# EAGLE design shield_v9 (EAGLE 6.5.0)
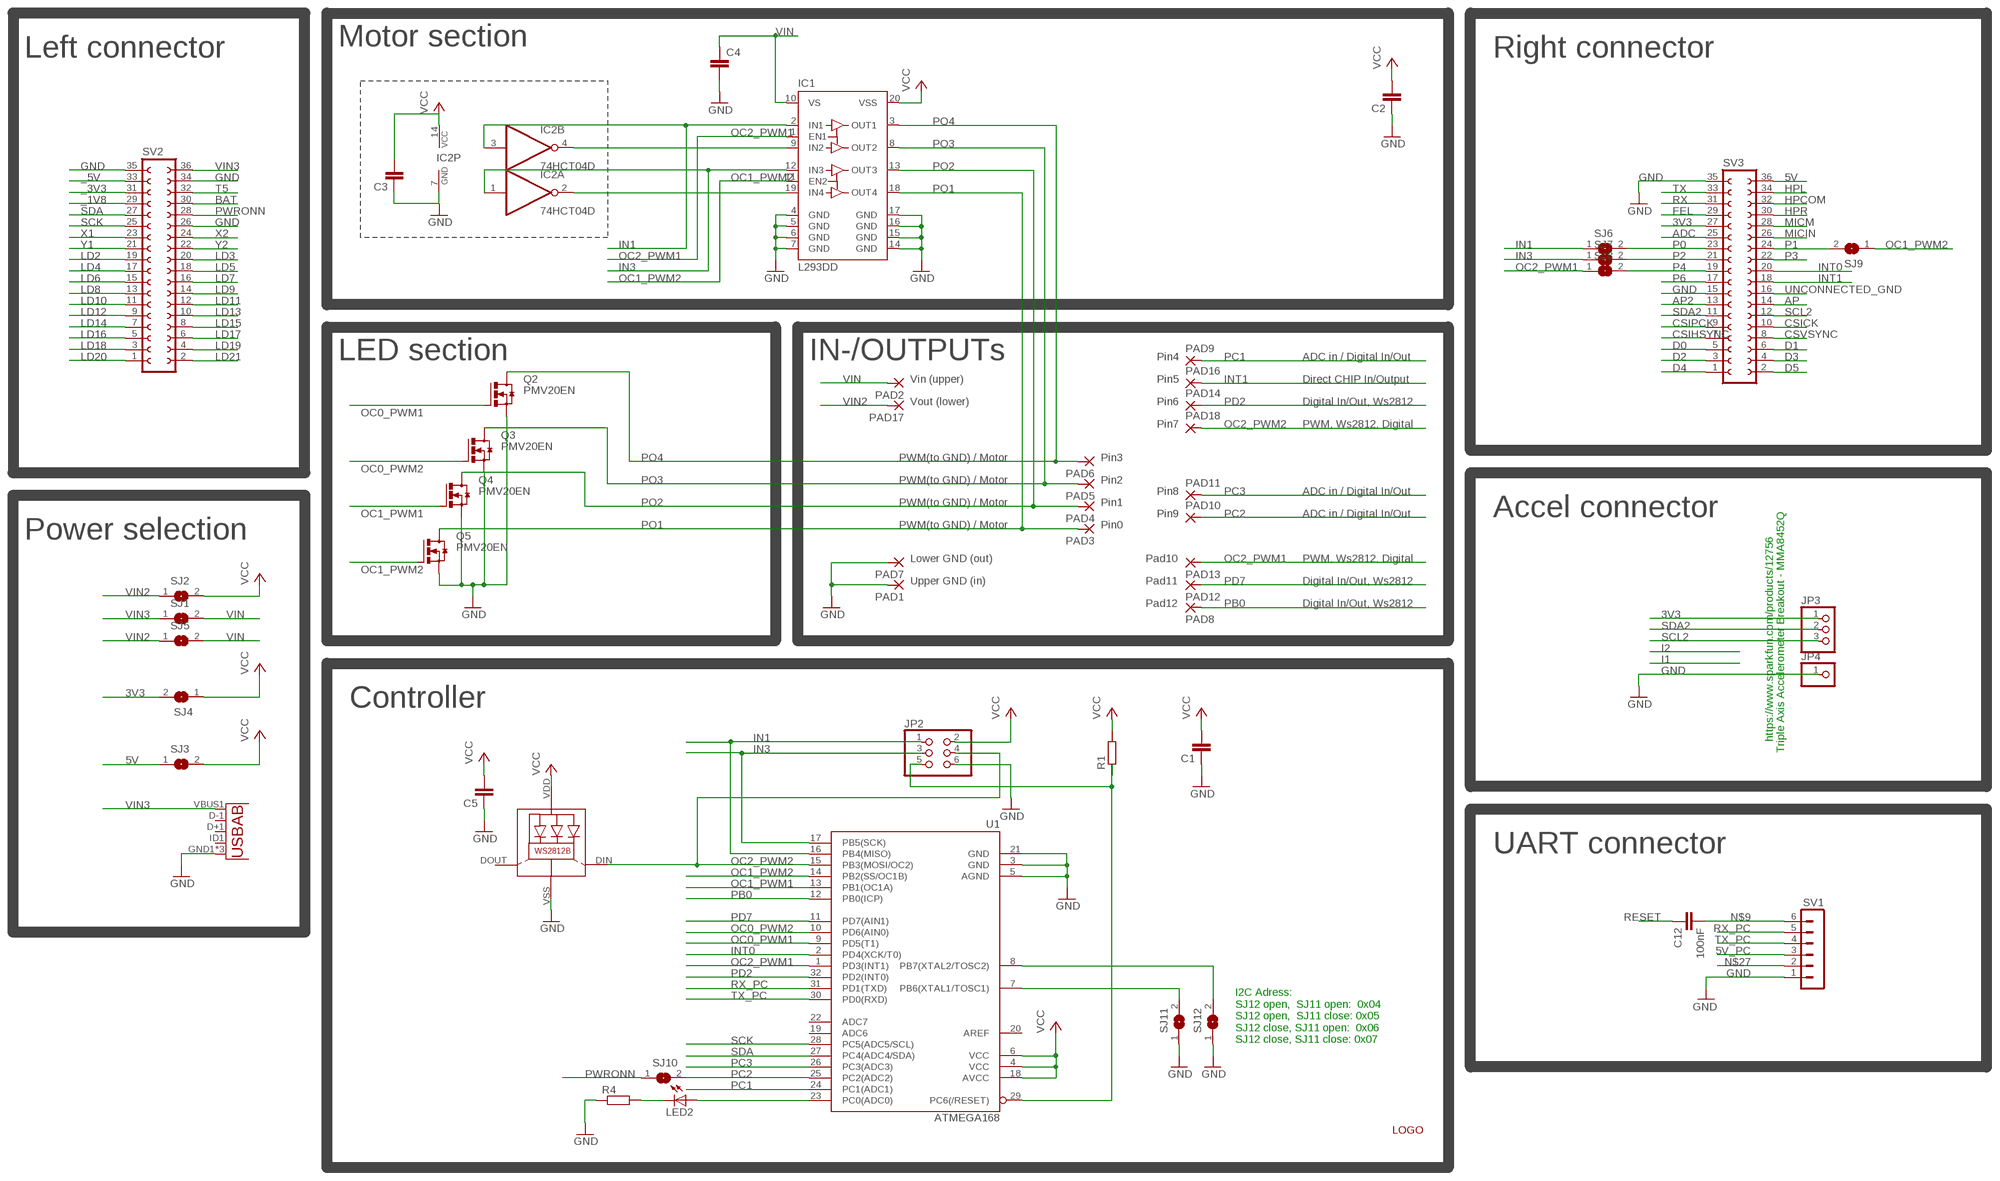
[diagram p0: schematic, sheet 1]

## Parts
C1  C-EUC0805  [C0805]
C2  C-EUC0805  [C0805]
C3  C-EUC0805  [C0805]
C4  C-EUC1210  [C1210]
C5  C-EUC0805  [C0805]
C12  100nF  C-EUC1206  [C1206]
IC1  L293DD  [SO20]
IC2  74HCT04D  [SO14]
JP2  PINHD-2X3  [2X03]
JP3  PINHD-1X3  [1X03]
JP4  PINHD-1X1  [1X01]
LED1  WS2812B  [WS2812B]
LED2  LEDCHIP-LED0805  [CHIP-LED0805]
PAD1  3,17/1,3  [3,17/1,3]
PAD2  3,17/1,3  [3,17/1,3]
PAD3  3,17/1,3  [3,17/1,3]
PAD4  3,17/1,3  [3,17/1,3]
PAD5  3,17/1,3  [3,17/1,3]
PAD6  3,17/1,3  [3,17/1,3]
PAD7  3,17/1,3  [3,17/1,3]
PAD8  WIREPADSMD1,27-254  [SMD1,27-2,54]
PAD9  3,17/1,3  [3,17/1,3]
PAD10  3,17/1,3  [3,17/1,3]
PAD11  3,17/1,3  [3,17/1,3]
PAD12  SMD2  [SMD1,27-2,54]
PAD13  SMD2  [SMD1,27-2,54]
PAD14  3,17/1,3  [3,17/1,3]
PAD16  3,17/1,3  [3,17/1,3]
PAD17  3,17/1,3  [3,17/1,3]
PAD18  3,17/1,3  [3,17/1,3]
Q2  PMV20EN  NMOSFET_SMD_223  [SOT223]
Q3  PMV20EN  NMOSFET_SMD_223  [SOT223]
Q4  PMV20EN  NMOSFET_SMD_223  [SOT223]
Q5  PMV20EN  NMOSFET_SMD_223  [SOT223]
R1  R-EU_M1206  [M1206]
R4  R-EU_M1206  [M1206]
SJ1  SJ  [SJ]
SJ2  SJ  [SJ]
SJ3  SJ  [SJ]
SJ4  SJ  [SJ]
SJ5  SJ  [SJ]
SJ6  SJ  [SJ]
SJ7  SJ  [SJ]
SJ8  SJ  [SJ]
SJ9  SJ  [SJ]
SJ10  SJ  [SJ]
SJ11  SJ  [SJ]
SJ12  SJ  [SJ]
SV1  MA06-1  [MA06-1]
SV2  FE18-2  [FE18-2]
SV3  FE18-2  [FE18-2]
U1  ATMEGA168  [TQFP32-08]
U2  USB""  [USB-MICRO-SMD]
U$2  LOGO  [LOGO]

## Nets
3V3: JP3.1 SJ4.2 SV3.27
5V: SJ3.1 SV3.36
5V_PC: SV1.3
_1V8: SV2.29
_3V3: SV2.31
_5V: SV2.33
ADC: SV3.25
AP: SV3.14
AP2: SV3.13
BAT: SV2.30
CSICK: SV3.10
CSIHSYNC: SV3.7
CSIPCK: SV3.9
CSVSYNC: SV3.8
D0: SV3.5
D1: SV3.6
D2: SV3.3
D3: SV3.4
D4: SV3.1
D5: SV3.2
FEL: SV3.29
GND: C1.1 C2.1 C3.1 C4.2 C5.1 IC1.4(GND) IC1.5(GND) IC1.6(GND) IC1.7(GND) IC1.14(GND) IC1.15(GND) IC1.16(GND) IC1.17(GND) IC2.7(P:GND) JP2.6 JP4.1 LED1.VSS(GND) PAD1.1(P) PAD7.1(P) Q2.3(S) Q3.3(S) Q4.3(S) Q5.3(S) R4.1 SJ11.1 SJ12.1 SV1.1 SV2.26 SV2.34 SV2.35 SV3.15 SV3.35 U1.3(GND) U1.5(AGND) U1.21(GND) U2.GND1(GND) U2.GND2(GND) U2.GND3(GND)
HPCOM: SV3.32
HPL: SV3.34
HPR: SV3.30
IN1: IC1.2(IN1) IC2.3(B:I) JP2.1 SJ6.1 U1.16(PB4(MISO))
IN3: IC1.12(IN3) IC2.1(A:I) JP2.3 SJ7.1 U1.17(PB5(SCK))
INT0: SV3.20 U1.2(PD4(XCK/T0))
INT1: PAD16.1(P) SV3.18
LD2: SV2.19
LD3: SV2.20
LD4: SV2.17
LD5: SV2.18
LD6: SV2.15
LD7: SV2.16
LD8: SV2.13
LD9: SV2.14
LD10: SV2.11
LD11: SV2.12
LD12: SV2.9
LD13: SV2.10
LD14: SV2.7
LD15: SV2.8
LD16: SV2.5
LD17: SV2.6
LD18: SV2.3
LD19: SV2.4
LD20: SV2.1
LD21: SV2.2
MICIN: SV3.26
MICM: SV3.28
N$1: IC1.19(IN4) IC2.2(A:O)
N$2: SJ11.2 U1.7(PB6(XTAL1/TOSC1))
N$3: SJ12.2 U1.8(PB7(XTAL2/TOSC2))
N$9: C12.2 SV1.6
N$11: IC1.9(IN2) IC2.4(B:O)
N$23: LED2.C R4.2
N$26: LED2.A U1.23(PC0(ADC0))
N$27: SV1.2
OC0_PWM1: Q2.1(G) U1.9(PD5(T1))
OC0_PWM2: Q3.1(G) U1.10(PD6(AIN0))
OC1_PWM1: Q4.1(G) U1.13(PB1(OC1A))
OC1_PWM2: IC1.11(EN2) Q5.1(G) SJ9.1 U1.14(PB2(SS/OC1B))
OC2_PWM1: IC1.1(EN1) PAD13.1(P) SJ8.1 U1.1(PD3(INT1))
OC2_PWM2: JP2.4 LED1.DIN(DI) PAD18.1(P) U1.15(PB3(MOSI/OC2))
P0: SJ6.2 SV3.23
P1: SJ9.2 SV3.24
P2: SJ7.2 SV3.21
P3: SV3.22
P4: SJ8.2 SV3.19
P6: SV3.17
PB0: PAD8.1(P) U1.12(PB0(ICP))
PC1: PAD9.1(P) U1.24(PC1(ADC1))
PC2: PAD10.1(P) SJ10.2 U1.25(PC2(ADC2))
PC3: PAD11.1(P) U1.26(PC3(ADC3))
PD2: PAD14.1(P) U1.32(PD2(INT0))
PD7: PAD12.1(P) U1.11(PD7(AIN1))
PO1: IC1.18(OUT4) PAD3.1(P) Q5.2(D) Q5.4(D)
PO2: IC1.13(OUT3) PAD4.1(P) Q4.2(D) Q4.4(D)
PO3: IC1.8(OUT2) PAD5.1(P) Q3.2(D) Q3.4(D)
PO4: IC1.3(OUT1) PAD6.1(P) Q2.2(D) Q2.4(D)
PWRONN: SJ10.1 SV2.28
RESET: C12.1 JP2.5 R1.1 U1.29(PC6(/RESET))
RX: SV3.31
RX_PC: SV1.5 U1.31(PD1(TXD))
SCK: SV2.25 U1.28(PC5(ADC5/SCL))
SCL2: JP3.3 SV3.12
SDA: SV2.27 U1.27(PC4(ADC4/SDA))
SDA2: JP3.2 SV3.11
T5: SV2.32
TX: SV3.33
TX_PC: SV1.4 U1.30(PD0(RXD))
UNCONNECTED_GND: SV3.16
VCC: C1.2 C2.2 C3.2 C5.2 IC1.20(VSS) IC2.14(P:VCC) JP2.2 LED1.VDD R1.2 SJ2.2 SJ3.2 SJ4.1 U1.4(VCC) U1.6(VCC) U1.18(AVCC)
VIN: C4.1 IC1.10(VS) PAD2.1(P) SJ1.2 SJ5.2
VIN2: PAD17.1(P) SJ2.1 SJ5.1
VIN3: SJ1.1 SV2.36 U2.VBUS1(VBUS)
X1: SV2.23
X2: SV2.24
Y1: SV2.21
Y2: SV2.22
Unconnected: IC2.5(C:I) IC2.6(C:O) IC2.8(D:O) IC2.9(D:I) IC2.10(E:O) IC2.11(E:I) IC2.12(F:O) IC2.13(F:I) LED1.DOUT(DO) U1.19(ADC6) U1.20(AREF) U1.22(ADC7) U2.D+1(D+) U2.D-1(D-) U2.ID1(USBID)

## Notes on the sheet
- Motor section
- Left connector | Right connector
- LED section | IN-/OUTPUTs | Pin4 | ADC in / Digital In/Out
- Vin (upper) | Pin5 | Direct CHIP In/Output
- Vout (lower) | Pin6 | Digital In/Out, Ws2812
- Pin7 | PWM, Ws2812, Digital
- PWM(to GND) / Motor | Pin3
- PWM(to GND) / Motor | Pin2
- Pin8 | ADC in / Digital In/Out
- PWM(to GND) / Motor | Pin1
- Pin9 | ADC in / Digital In/Out | Accel connector
- PWM(to GND) / Motor | Pin0
- Power selection
- Lower GND (out) | Pad10 | PWM, Ws2812, Digital
- Upper GND (in) | Pad11 | Digital In/Out, Ws2812
- Pad12 | Digital In/Out, Ws2812
- Controller
- https://www.sparkfun.com/products/12756
- Triple Axis Accelerometer Breakout - MMA8452Q
- UART connector
- I2C Adress: 
  SJ12 open,  SJ11 open:  0x04
  SJ12 open,  SJ11 close: 0x05
  SJ12 close, SJ11 open:  0x06
  SJ12 close, SJ11 close: 0x07

## Library data of the parts
C1-C5 C12 = rcl:C-EU: CAPACITOR, European symbol
IC1 = st-microelectronics:L293DD: PUSH-PULL FOUR CHANNEL DRIVER WITH DIODES Source: http://www.st.com/stonline/books/pdf/docs/1330.pdf; OC_FARNELL: unknown
IC2 = 74xx-eu:74*04: Hex INVERTER
JP2 = pinhead:PINHD-2X3: PIN HEADER
JP3 = adafruit:PINHD-1X3: PIN HEADER
JP4 = adafruit:PINHD-1X1: Pin header 1x1 for 0.1" spacing With round pins
LED1 = WS2812B:WS2812B: Features and Benefits  * Intelligent reverse connect protection, the power supply reverse connection does not damage the IC. * The control circuit and the LED share the only power source. Control circuit and RGB chip are integrated in a package of 5050 components, form a complete control of pixel point.  * Built-in signal reshaping circuit, after wave reshaping to the next driver, ensure wave-form distortion not accumulate.  * Built-in electric reset circuit and power lost reset circuit.  * Each pixel of the three primary color can achieve 256 brightness display, completed 16777216 color full color display, and scan frequency not less than 400Hz/s.  * Cascading port transmission signal by single line.  * Any two point the distance more than 5m transmission signal without any increase circuit.  * When the refresh rate is 30fps, cascade number are not less than1024 points.  * Send data at speeds of 800Kbps.  *The color of the light were highly consistent, cost-effective. Applications  Full-color module, Full color soft lights a lamp strip. LED decorative lighting, Indoor/outdoor LED video irregular screen. General description WS2812B is a intelligent control LED light source that the control circuit and RGB chip are integrated in a package of 5050 components. It internal include intelligent digital port data latch and signal reshaping amplification drive circuit. Also include a precision internal oscillator and a 12V voltage programmable constant curre-nt control part, effectively ensuring the pixel point light color height consistent. The data transfer protocol use single NZR communication mode. After the pixel power-on reset, the DIN port receive data from controller, the first pixel collect initial 24bit data then sent to the internal data latch, the other data which reshaping by the internal signal reshaping amplification circuit sent to the next cascade pixel through the DO port. After transmission for each pixel,the signal to reduce 24bit. pixel adopt auto reshaping transmit technology, making the pixel cascade number is not limited the signal transmission, only depend on the speed of signal transmission. LED with low driving voltage, environmental protection and energy saving, high brightness, scattering angle is large, good consistency, low power, long life and other advantages. The control chip integrated in LED above becoming more simple circuit, small volume, convenient installation. Absolute Maximum Ratings Power supply voltage: VDD +3.5V..+5.3V Input voltage: VI -0.5V..VDD+0.5V based on WS2812 from https://github.com/adafruit/Adafruit-Eagle-Library
LED2 = led:LED: LED OSRAM: - CHIPLED LG R971, LG N971, LY N971, LG Q971, LY Q971, LO R971, LY R971 LH N974, LH R974 LS Q976, LO Q976, LY Q976 LO Q996 - Hyper CHIPLED LW Q18S LB Q993, LB Q99A, LB R99A - SideLED LS A670, LO A670, LY A670, LG A670, LP A670 LB A673, LV A673, LT A673, LW A673 LH A674 LY A675 LS A676, LA A676, LO A676, LY A676, LW A676 LS A679, LY A679, LG A679 - Hyper Micro SIDELED® LS Y876, LA Y876, LO Y876, LY Y876 LT Y87S - SmartLED LW L88C, LW L88S LB L89C, LB L89S, LG L890 LS L89K, LO L89K, LY L89K LS L896, LA L896, LO L896, LY L896 - TOPLED LS T670, LO T670, LY T670, LG T670, LP T670 LSG T670, LSP T670, LSY T670, LOP T670, LYG T670 LG T671, LOG T671, LSG T671 LB T673, LV T673, LT T673, LW T673 LH T674 LS T676, LA T676, LO T676, LY T676, LB T676, LH T676, LSB T676, LW T676 LB T67C, LV T67C, LT T67C, LS T67K, LO T67K, LY T67K, LW E67C LS E67B, LA E67B, LO E67B, LY E67B, LB E67C, LV E67C, LT E67C LW T67C LS T679, LY T679, LG T679 LS T770, LO T770, LY T770, LG T770, LP T770 LB T773, LV T773, LT T773, LW T773 LH T774 LS E675, LA E675, LY E675, LS T675 LS T776, LA T776, LO T776, LY T776, LB T776 LHGB T686 LT T68C, LB T68C - Hyper Mini TOPLED® LB M676 - Mini TOPLED Santana® LG M470 LS M47K, LO M47K, LY M47K Source: http://www.osram.convergy.de LUXEON: - LUMILED® LXK2-PW12-R00, LXK2-PW12-S00, LXK2-PW14-U00, LXK2-PW14-V00 LXK2-PM12-R00, LXK2-PM12-S00, LXK2-PM14-U00 LXK2-PE12-Q00, LXK2-PE12-R00, LXK2-PE12-S00, LXK2-PE14-T00, LXK2-PE14-U00 LXK2-PB12-K00, LXK2-PB12-L00, LXK2-PB12-M00, LXK2-PB14-N00, LXK2-PB14-P00, LXK2-PB14-Q00 LXK2-PR12-L00, LXK2-PR12-M00, LXK2-PR14-Q00, LXK2-PR14-R00 LXK2-PD12-Q00, LXK2-PD12-R00, LXK2-PD12-S00 LXK2-PH12-R00, LXK2-PH12-S00 LXK2-PL12-P00, LXK2-PL12-Q00, LXK2-PL12-R00 Source: www.luxeon.com KINGBRIGHT: KA-3528ASYC Source: www.kingbright.com
PAD1-PAD7 PAD9-PAD11 PAD14 PAD16-PAD18 = wirepad:3,17/1,3: THROUGH-HOLE PAD
PAD8 = wirepad:WIREPAD: Wire PAD connect wire on PCB
PAD12 PAD13 = wirepad:SMD2: SMD PAD
Q2-Q5 = transistor-power:NMOSFET_SMD_223
R1 R4 = rcl:R-EU_: RESISTOR, European symbol
SJ1-SJ12 = jumper:SJ: SMD solder JUMPER
SV1 = con-lstb:MA06-1: PIN HEADER; OC_FARNELL: unknown; OC_NEWARK: unknown
SV2 SV3 = con-lsta:FE18-2: FEMALE HEADER; OC_FARNELL: unknown; OC_NEWARK: unknown
U1 = SparkFun-DigitalIC:ATMEGA168: Atmel 32-pin 8-bit micro, 16k flash.
U2 = MicroUSB:USB: This is a USB AB connector that is compatible with USB OTG. i.e. this connector can serve as a host or device
U$2 = logo:LOGO

## Board
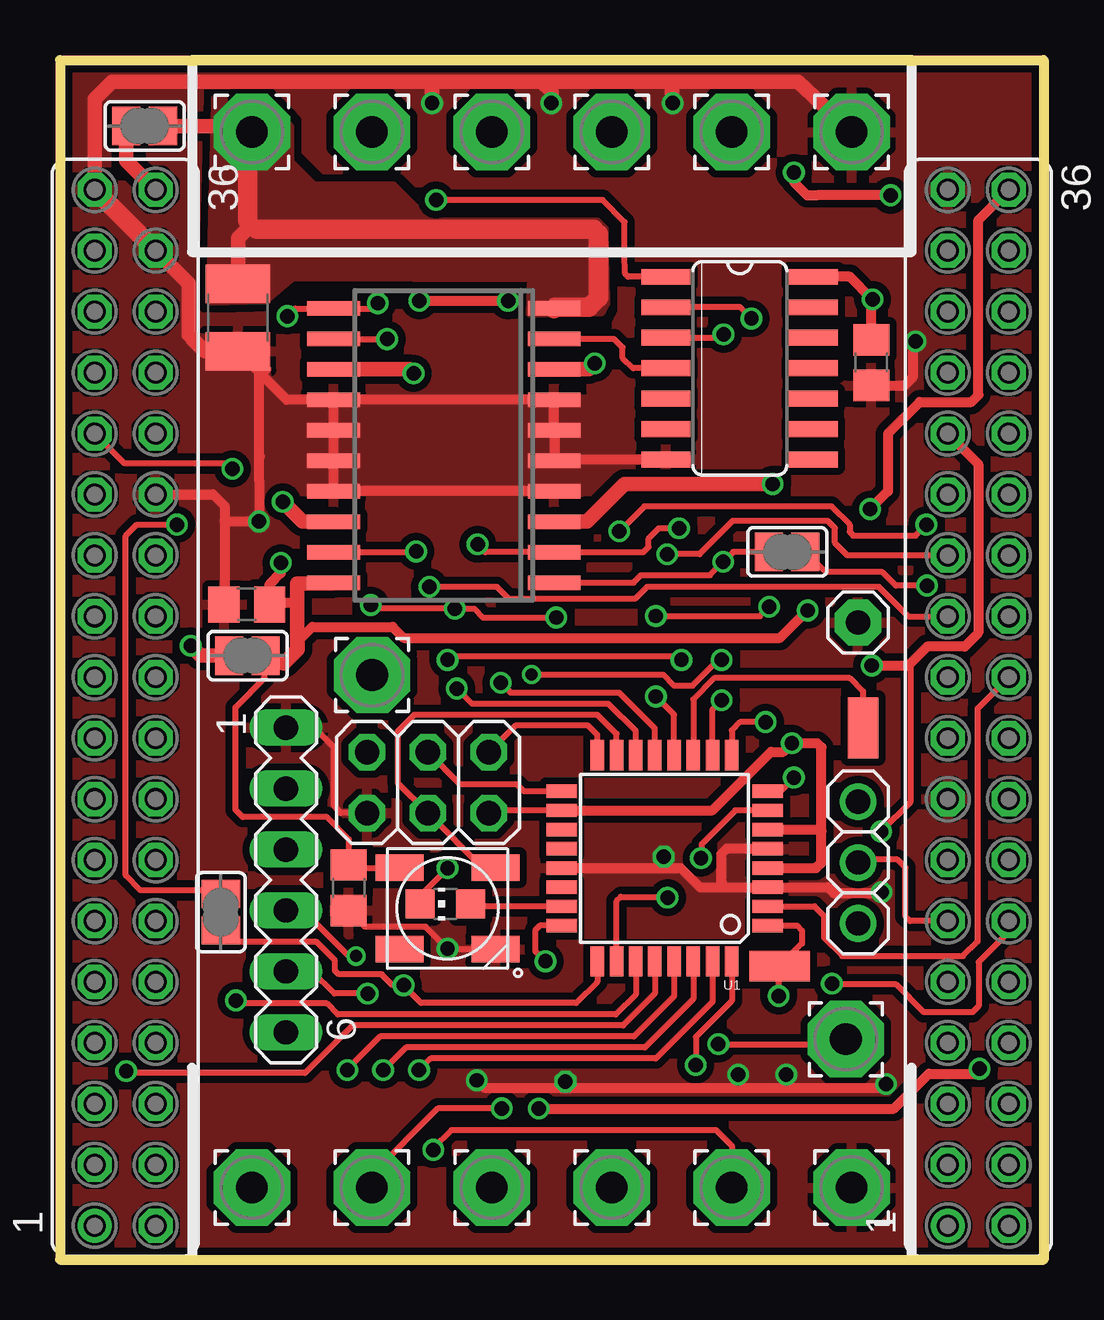
[diagram p1: board, top side]
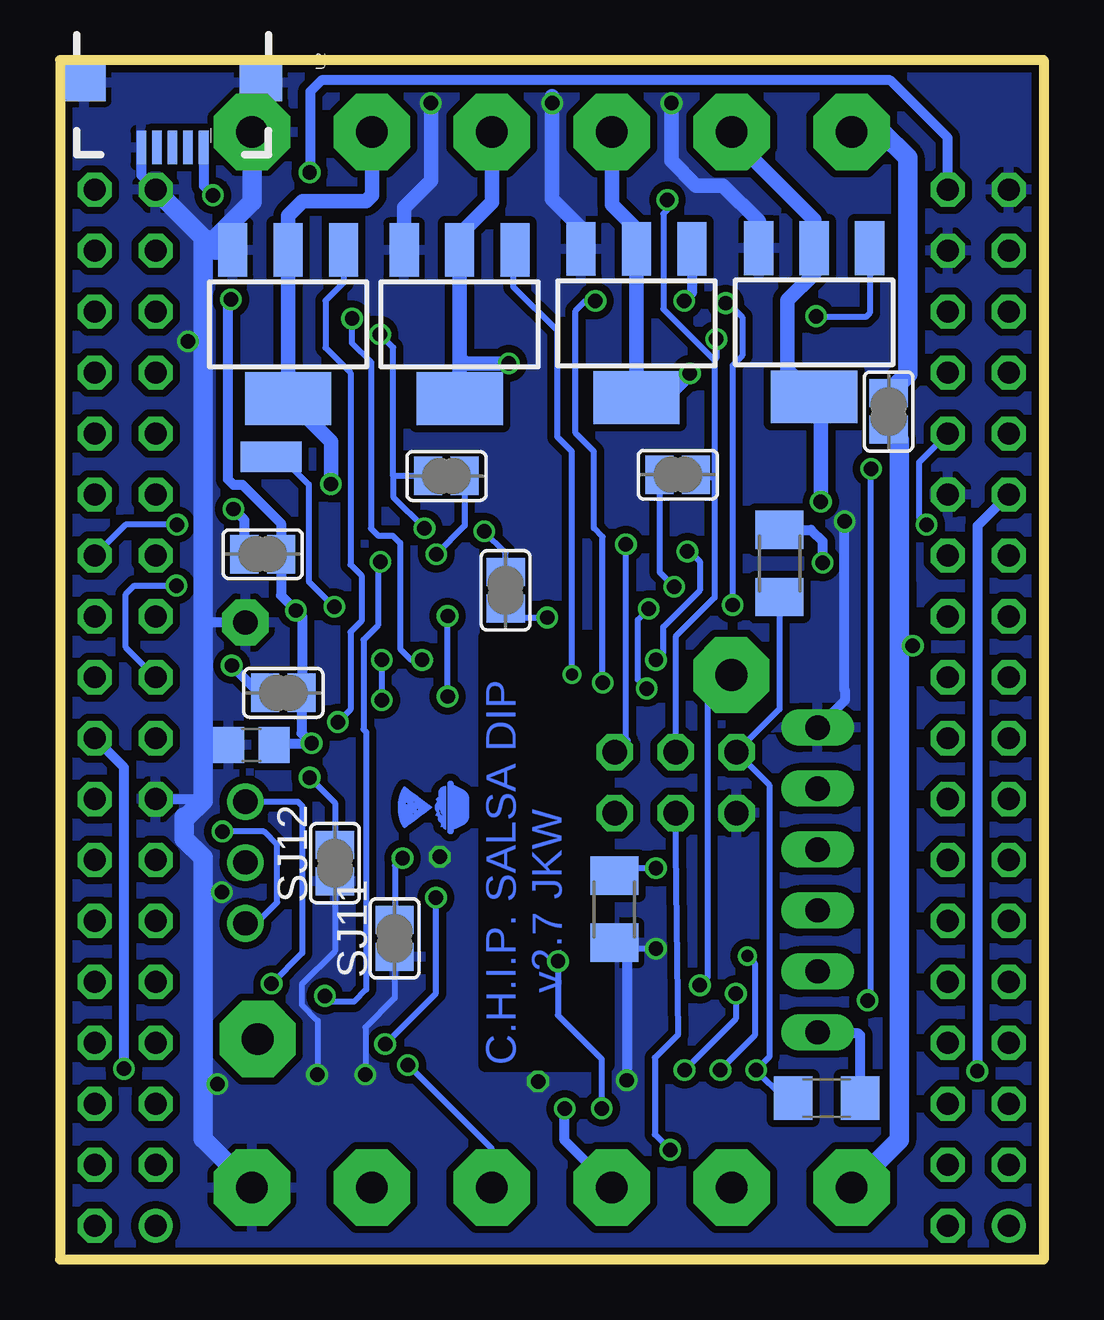
[diagram p2: board, bottom side, seen from below]

Size 41 x 50 mm. Coordinates in mm from the lower left corner, seen from the top.
Outline: 0,50 41,50 41,0 0,0 0,50
Copper layers (1*16): Top 0.035mm / dielectric 1.5mm / Bottom 0.035mm
Design rules "SeeedStudio_2layer_DRU_no_angle_20140221": minimum track width 6mil, minimum drill 12mil, track to track 6mil, track to pad 6mil, pad to pad 6mil, via to via 6mil, smd to smd 0mil, copper to edge 10mil, drill to drill 10mil, minimum pad ring 10mil, minimum via ring 6mil, stop-mask expansion 2mil, vias tented up to drill 100mil, thermal gap 10mil

### Footprints (pad centres in the part's own frame; a part is rotated, then mirrored left to right if it is on the bottom)
C0805 = smd 1.3 x 1.5: 1 -0.95,0; 2 0.95,0
C1210 = smd 1.6 x 2.7: 1 -1.4,0; 2 1.4,0
C1206 = smd 1.6 x 1.8: 1 -1.4,0; 2 1.4,0
SO20 = smd 0.6 x 2.2: 1 -5.715,-4.6; 2 -4.445,-4.6; 3 -3.175,-4.6; 4 -1.905,-4.6; 5 -0.635,-4.6; 6 0.635,-4.6; 7 1.905,-4.6; 8 3.175,-4.6; 9 4.445,-4.6; 10 5.715,-4.6; 11 5.715,4.6; 12 4.445,4.6; 13 3.175,4.6; 14 1.905,4.6; 15 0.635,4.6; 16 -0.635,4.6; 17 -1.905,4.6; 18 -3.175,4.6; 19 -4.445,4.6; 20 -5.715,4.6
SO14 = smd 0.66 x 2.032: 1 -3.81,-3.073; 2 -2.54,-3.073; 3 -1.27,-3.073; 4 0,-3.073; 5 1.27,-3.073; 6 2.54,-3.073; 7 3.81,-3.073; 8 3.81,3.073; 9 2.54,3.073; 10 1.27,3.073; 11 0,3.073; 12 -1.27,3.073; 13 -2.54,3.073; 14 -3.81,3.073
2X03 = drill 1.016 octagon: 1 -2.54,-1.27; 2 -2.54,1.27; 3 0,-1.27; 4 0,1.27; 5 2.54,-1.27; 6 2.54,1.27
1X03 = drill 1.016: 1 -2.54,0; 2 0,0; 3 2.54,0
1X01 = drill 1.016 pad 1.93 octagon: 1 0,0
WS2812B = smd 2 x 1.1: DIN 2,1.7; DOUT -2,-1.7; VDD -2,1.7; VSS 2,-1.7
CHIP-LED0805 = smd 1.2 x 1.2: A 0,-1.05; C 0,1.05
3,17/1,3 = drill 1.321 pad 3.175 octagon: 1 0,0
SMD1,27-2,54 = smd 1.27 x 2.54: 1 0,0
SOT223 = smd 1.219 x 2.235: 1 -2.311,-3.099; 2 0,-3.099; 3 2.311,-3.099 | smd 3.6 x 2.2: 4 0,3.099
M1206 = smd 1.6 x 2: 1 -1.4,0; 2 1.4,0
SJ = smd 1.168 x 1.6: 1 -0.762,0; 2 0.762,0
MA06-1 = drill 1.016 long: 1 -6.35,0; 2 -3.81,0; 3 -1.27,0; 4 1.27,0; 5 3.81,0; 6 6.35,0
FE18-2 = drill 0.914: 1 -21.59,1.27 | drill 0.914 octagon: 2 -21.59,-1.27; 3 -19.05,1.27; 4 -19.05,-1.27; 5 -16.51,1.27; 6 -16.51,-1.27; 7 -13.97,1.27; 8 -13.97,-1.27; 9 -11.43,1.27; 10 -11.43,-1.27; 11 -8.89,1.27; 12 -8.89,-1.27; 13 -6.35,1.27; 14 -6.35,-1.27; 15 -3.81,1.27; 16 -3.81,-1.27; 17 -1.27,1.27; 18 -1.27,-1.27; 19 1.27,1.27; 20 1.27,-1.27; 21 3.81,1.27; 22 3.81,-1.27; 23 6.35,1.27; 24 6.35,-1.27; 25 8.89,1.27; 26 8.89,-1.27; 27 11.43,1.27; 28 11.43,-1.27; 29 13.97,1.27; 30 13.97,-1.27; 31 16.51,1.27; 32 16.51,-1.27; 33 19.05,1.27; 34 19.05,-1.27; 35 21.59,1.27; 36 21.59,-1.27
TQFP32-08 = smd 1.27 x 0.559: 1 -4.293,2.8; 2 -4.293,2; 3 -4.293,1.2; 4 -4.293,0.4; 5 -4.293,-0.4; 6 -4.293,-1.2; 7 -4.293,-2; 8 -4.293,-2.8; 17 4.293,-2.8; 18 4.293,-2; 19 4.293,-1.2; 20 4.293,-0.4; 21 4.293,0.4; 22 4.293,1.2; 23 4.293,2; 24 4.293,2.8 | smd 0.559 x 1.27: 9 -2.8,-4.293; 10 -2,-4.293; 11 -1.2,-4.293; 12 -0.4,-4.293; 13 0.4,-4.293; 14 1.2,-4.293; 15 2,-4.293; 16 2.8,-4.293; 25 2.8,4.293; 26 2,4.293; 27 1.2,4.293; 28 0.4,4.293; 29 -0.4,4.293; 30 -1.2,4.293; 31 -2,4.293; 32 -2.8,4.293
USB-MICRO-SMD = smd 1.4 x 0.4: D+1 2.7,0; D-1 2.7,0.65; GND1 2.7,-1.3; ID1 2.7,-0.65; VBUS1 2.7,1.3 | smd 1.524 x 1.778: GND2 0,3.683; GND3 0,-3.683

### Placement (x,y rotation side)
C1  33.02,21.45 0 bottom
C2  7.78,27.31 0 top
C3  33.82,37.39 90 top
C4  7.42,39.26 270 top
C5  12.04,15.49 90 top
C12  9.04,6.73 0 bottom
IC1  16,33.93 90 top
IC2  28.34,37.15 270 top
JP2  15.34,19.88 180 top
JP3  33.27,16.55 90 top
JP4  33.27,26.55 0 top
LED1  16.15,14.63 0 top
LED2  16.06,14.82 90 top
PAD1  33,47 0 top
PAD2  8,47 0 top
PAD3  13,47 0 top
PAD4  18,47 0 top
PAD5  23,47 0 top
PAD6  28,47 0 top
PAD7  33,3 0 top
PAD8  32.19,33.45 270 bottom
PAD9  13,3 0 top
PAD10  13.01,24.36 0 top
PAD11  32.76,9.18 0 top
PAD12  33.47,22.16 180 top
PAD13  30,12.23 90 top
PAD14  23,3 0 top
PAD16  18,3 0 top
PAD17  8,3 0 top
PAD18  28,3 0 top
Q2  31.49,38.98 180 bottom
Q3  24.34,38.98 180 bottom
Q4  16.97,39.02 180 bottom
Q5  9.56,39.06 180 bottom
R1  11,29.02 90 bottom
R4  17.89,14.6 90 bottom
SJ1  3.53,47.25 0 top
SJ2  7.82,25.17 0 top
SJ3  32.55,29.4 0 bottom
SJ4  31.69,23.62 180 bottom
SJ5  6.46,35.35 90 bottom
SJ6  24.89,32.66 0 bottom
SJ7  15.24,32.71 180 bottom
SJ8  30.32,29.5 0 top
SJ9  22.42,27.89 90 bottom
SJ10  6.71,14.48 270 top
SJ11  27.05,13.39 90 bottom
SJ12  29.54,16.52 90 bottom
SV1  9.42,15.82 270 top
SV2  2.72,23 90 top
SV3  38.28,23 90 top
U1  25.2,16.72 180 top
U2  36.31,49.05 270 bottom
U$2  23.81,20.14 270 top

### Tracks (layer width: path | path; a pad name or v marks a point on that pad's centre or on a via)
3V3  (via drill 0.6)
  Top 0.254: 35.46,24.86 35.46,19.07 v34.23,17.84
  Top 0.406: SV3.27 38.28,33.16 38.28,26.12 37.71,25.55 36.15,25.55 35.46,24.86 35.36,24.76 v33.84,24.76
  Bottom 0.254: JP3.1 32.82,14.01 31.94,14.89 31.94,17.28 32.5,17.84 v34.23,17.84
  Bottom 0.406: v33.84,24.76 32.7,23.62 SJ4.2
5V  (via drill 0.6)
  Top 0.406: v33.77,31.28 34.52,32.03 34.52,34.42 35.84,35.74 37.99,35.74 38.29,36.04 38.29,43.33 SV3.36
  Bottom 0.406: SJ3.1 33.31,30.82 v33.77,31.28
GND  (via drill 0.6)
  Top 0.152: 11.43,34.29 11.4,34.74 | 11.43,35.56 11.4,35.56
  Top 0.254: JP2.6 11.72,18.61 11.43,18.9 11.43,21.34 10.67,22.1 9.49,22.1 SV1.1 | 34.29,7.16 v34.44,7.32 | LED1.VSS 16.48,12.93 v16.15,12.95 15.24,13.87 12.71,13.87 C5.1 | v28.27,7.71 28.27,7.34 28.09,7.16 | v30.28,7.71 30.28,7.3 30.14,7.16
  Top 0.406: U1.3 32.01,15.52 32.25,15.28 33.92,15.28 v34.26,15.31 | 8.3,33.48 8.34,33.48 8.3,33.44 | 8.3,33.48 8.3,33.44 | 8.3,32.5 8.3,33.44 | U1.21 25.87,16.32 26.67,15.52 U1.3 | 29.45,17.08 U1.5 27.79,17.12 27.56,16.89 27.56,15.73 27.77,15.52 U1.3 | IC1.14 IC1.7 IC1.6 20.64,34.52 20.64,33.34 | IC1.4 IC1.17 IC1.16 IC1.15 | C4.2 6.03,37.86 | 5.51,38.38 5.51,38.4 | 8.3,32.5 8.29,32.49 | 8.6,37.1 8.41,37.28 | 11.4,34.74 IC1.15 | v17.37,7.47 17.68,7.16 28.09,7.16 30.14,7.16 34.29,7.16 | C3.1 35.2,36.44 35.57,36.8 35.57,38.18 v35.66,38.27 | SV2.26 6.38,31.89 6.86,31.41 6.86,30.79 | 6.86,30.79 6.86,27.33 C2.1 | 8.3,32.5 8.3,30.77 v8.29,30.76 6.88,30.76 6.86,30.79 | IC1.14 9.45,35.84 C4.2 | 8.3,33.48 8.3,36.98 C4.2 | IC1.15 IC1.14 | 11.43,34.29 11.43,34.53 IC1.15 | IC2.7 20.64,33.34 | 20.64,33.34 IC1.5 | 11.4,35.56
  Top 0.61: 15.51,49.1 2.18,49.1 1.45,48.37 SV2.35 | 15.51,49.1 20.08,49.1 | 20.08,49.1 25.51,49.1 | 25.51,49.1 30.77,49.1 PAD1.1 | v25.54,48.2 25.51,48.52 25.51,49.1 | v15.51,48.2 15.51,49.1 | 6.03,37.86 5.51,38.38 | 5.51,38.4 5.36,38.55 5.36,40.68 SV2.34 | v20.48,48.2 20.48,48.7 20.08,49.1
  Top 0.813: SV2.35 SV2.34
  Bottom 0.254: 17.37,12.68 R4.1 17.65,12.95 v16.15,12.95 | SJ11.1 27.05,10.9 28.27,9.68 v28.27,7.71 | SJ12.1 29.54,12.85 30.92,11.47 30.92,10.63 30.25,9.96 30.25,7.73 v30.28,7.71
  Bottom 0.406: SV3.15 35.11,19.19 35.04,19.12 | C1.1 34.87,21.33 | SV1.1 8.29,23.3 8.29,23.73 8.3,23.74 v8.3,30.75 v8.29,30.76 | 35.05,15.41 35.04,15.42 | v34.26,15.31 34.93,15.31 35.04,15.2 | C1.1 35,21.45 35.04,21.41 | C1.1 34.9,21.45 34.92,21.43 | JP4.1 34.89,26.55 35.04,26.4 | 17.37,12.68 v17.37,7.47 | v34.44,7.32 35.04,7.32 | v35.66,38.27 35.04,38.27 | U2.GND1 37.61,45.19 SV3.35
  Bottom 0.61: Q3.3 26.65,43.85 25.54,44.96 v25.54,48.2 | v20.48,48.2 20.49,48.48 20.49,44.2 19.28,42.99 Q4.3 | Q5.3 11.87,43.28 13.36,44.77 14.48,44.77 15.51,45.8 v15.51,48.2
  Bottom 0.813: 35.04,42.6 35.04,38.27 35.04,26.4 35.04,21.41 35.04,19.12 35.72,18.44 35.81,18.44 35.81,17.53 35.04,16.75 35.04,15.42 35.04,15.2 35.04,7.32 35.04,5.04 PAD7.1 | Q2.3 34.52,42.08 34.76,42.33 | 34.76,42.33 35.04,42.6 | PAD1.1 33,44.09 34.76,42.33 | SV3.35 37.01,44.57 35.04,42.6
  other vias: 25.17,16.79 21.07,7.42
  pour Top (no thermals): 8.83,35.83 21.96,35.88 22.35,35.87 23.02,35.87 23.6,35.22 23.77,33.78 21.71,31.96 10.64,32.04 7.45,34.41 5.84,34.41 5.59,34.66 5.68,38.46 6.07,38.38 7.13,38.41 7.18,38.33 8.28,38.23
  pour Top (isolate 0.305, rank 2): -0.07,0.25 40.88,0.25 41.01,10.57 41.01,50.01 0,50.01 0,10.47
  pour Bottom (isolate 0.305): 0,50 41.05,50 41.05,0.25 0.02,0.25 0.02,49.92
IN1  (via drill 0.6)
  Top 0.254: U1.16 22.4,21.87 22.02,22.25 18.98,22.25 JP2.1 | IC2.3 27.52,38.42 v27.66,38.56 | v17.41,29.81 17.73,29.48 IC1.2 24.32,29.48 24.54,29.7 24.54,30.05 24.97,30.48 v25.81,30.48
  Bottom 0.254: 27.11,32.66 27.11,38.01 v27.66,38.56 | SJ6.1 27.11,32.66 | 17.41,21.62 v17.41,29.81 | 27.11,32.66 27.11,31.78 v25.81,30.48
  Bottom 0.406: JP2.1 17.41,21.62
IN3  (via drill 0.6)
  Top 0.254: v15.68,44.17 22.62,44.17 23.54,43.25 23.54,41.92 23.56,41.08 23.68,40.96 IC2.1 | U1.17 19.34,19.52 19.05,19.81 16.68,19.81 JP2.3 | IC1.12 v13.63,38.38 v13.64,38.37
  Bottom 0.254: JP2.3 15.34,25.96 13.72,27.58 13.72,32.61 | v15.68,44.17 15.68,43.76 15.85,43.59 15.85,39.62 13.72,37.49 | 13.72,37.49 13.72,32.61 | SJ7.1 14.38,32.61 13.72,32.61 | v13.64,38.37 13.64,37.57 13.72,37.49
INT0
  Top 0.254: U1.2 31.46,14.72 31.85,14.33 31.85,13.41 32.61,12.65 37.64,12.65 38.25,13.26 38.25,22.97 SV3.20
INT1  (via drill 0.6)
  Top 0.406: v19.96,6.29 34.76,6.29 36.22,7.75 38.13,7.75 v38.33,7.95
  Bottom 0.406: PAD16.1 19.96,4.96 v19.96,6.29 | v38.33,7.95 38.33,20.51 SV3.18
N$1  (via drill 0.6)
  Top 0.254: v16.15,24.99 16.46,25.15 25.76,25.15 v25.91,24.99 | 26.05,39.71 28.34,39.71 v28.82,39.22 | IC1.19 14.82,29.48 v14.85,29.52
  Top 0.406: 26.05,39.71 IC2.2
  Bottom 0.254: v16.15,24.99 15.85,25.3 15.85,26.36 14.33,27.89 14.33,29.1 14.74,29.52 v14.85,29.52 | v25.91,24.99 26.36,24.99 26.82,25.45 26.82,29.87 27.13,30.18 27.74,30.18 28.04,30.48 28.04,37.42 28.82,38.2 v28.82,39.22
N$2  (via drill 0.6)
  Top 0.254: U1.7 28.16,18.72 26.75,17.31 26.75,16.75 v26.72,16.73
  Bottom 0.254: v26.72,16.73 27.04,16.41 27.04,14.16 SJ11.2
N$3  (via drill 0.6)
  Top 0.254: U1.8 30.02,19.52 v30.59,20.09
  Bottom 0.254: v30.59,20.09 29.54,19.04 SJ12.2
N$9
  Bottom 0.406: C12.2 7.64,9.35 7.71,9.42 9.37,9.42 SV1.6
N$11
  Top 0.254: IC2.4 23.89,37.15 23.46,37.58 23.46,38.01 23.09,38.38 IC1.9
N$23  (via drill 0.6)
  Top 0.254: LED2.C 15.01,15.16 v16.15,16.31
  Bottom 0.254: v16.15,16.31 17.59,16.31 arc-90 R4.2
N$26
  Top 0.254: U1.23 17.21,14.72
  Top 0.406: 17.21,14.72 LED2.A
OC0_PWM1  (via drill 0.6)
  Top 0.254: v29.41,22.4 28.35,22.4 28,22.06 U1.9
  Bottom 0.254: v29.41,22.4 28.89,22.93 28.89,26.15 28.43,26.61 28.43,28.51 28.89,28.97 28.89,36.96 29.93,38 29.93,39.97 29.18,40.72 29.18,41.42
  Bottom 0.406: 29.18,41.42 Q2.1
OC0_PWM2  (via drill 0.5, 0.6)
  Top 0.254: U1.10 27.2,22.93 v27.58,23.32 | v27.58,24.99 27.43,24.99 26.36,23.93 25.6,23.93 25.15,24.38 v19.66,24.38
  Bottom 0.254: v27.58,24.99 v27.58,23.32 | v19.66,24.38 19.66,33.68 20.27,34.29 20.27,38.71 22.1,40.54 22.1,42.01 Q3.1
  Bottom 0.406: Q3.1 22.06,42.05
OC1_PWM1  (via drill 0.6)
  Top 0.254: U1.13 24.8,22.14 23.32,23.62 18.8,23.62 v18.38,24.04
  Top 0.406: v14.98,39.96 v18.68,39.96
  Bottom 0.254: v18.38,24.04 18.38,30.12 18.75,30.48 18.75,33.68 19.51,34.44 19.51,39.54 19.09,39.96 v18.68,39.96
  Bottom 0.406: Q4.1 14.66,40.28 v14.98,39.96
OC1_PWM2  (via drill 0.6)
  Top 0.254: U1.14 24,22.02 22.86,23.16 17.18,23.16 v16.54,23.8 | v12.95,27.28 13.11,27.13 v16.46,27.13 17.27,27.13 17.64,26.76 v20.69,26.76 | v9.48,39.32 9.8,39.65 IC1.11 13.03,39.65 v13.25,39.87
  Bottom 0.254: v9.48,39.32 9.45,39.29 7.41,39.29 7.25,39.45 Q5.1 | v16.54,23.8 16.92,24.17 16.92,26.67 v16.46,27.13 | v13.25,39.87 13.14,39.87 12.56,39.28 12.56,37.68 12.97,37.27 12.97,27.29 v12.95,27.28 | SJ9.1 22.05,26.76 v20.69,26.76
  Bottom 0.406: 7.25,42.99 Q5.1
OC2_PWM1  (via drill 0.6)
  Top 0.254: U1.1 30.73,13.92 30.94,13.72 30.94,13.17 PAD13.1 29.96,12.19 v29.96,10.99 | SJ8.1 28.07,29.5 v27.65,29.08 | v27.65,29.08 27.65,28.87 | v27.65,29.08 27.09,28.52 24.22,28.52 23.91,28.21 IC1.1
  Top 0.406: 30.39,11.84 PAD13.1 30.39,12.23
  Bottom 0.254: v27.65,29.08 27.75,28.98 27.75,26.43 28.35,25.83 28.35,22.1 28.23,21.98 28.23,11.25 28.74,10.74 29.72,10.74 v29.96,10.99
OC2_PWM2  (via drill 0.6)
  Top 0.254: 15.56,4.63 16.32,5.39 27.36,5.39 28,4.75 PAD18.1 | U1.15 23.2,21.91 22.4,22.71 14.77,22.71 14.08,22.02 14.08,19.87 JP2.4 17.62,16.33 LED1.DIN
  Top 0.406: v15.56,4.57 15.56,4.63
  Bottom 0.254: JP2.4 15.22,9.39 16.2,8.41 16.2,5.21 v15.56,4.57
P0  (via drill 0.6)
  Top 0.254: SV3.23 32.83,29.35 32.31,29.87 32.31,30.48 32,30.79 28.04,30.79 26.66,29.4 v25.31,29.4
  Top 0.406: 36.98,29.38 SV3.23
  Bottom 0.254: SJ6.2 24.13,30.58 v25.31,29.4
P1  (via drill 0.6)
  Top 0.254: v36.12,30.63 35.66,30.18 33.07,30.18 32.92,30.33 32.92,30.63 32.16,31.39 24.36,31.39 v23.32,30.35
  Bottom 0.254: v36.12,30.63 38.27,30.63 SV3.24 | SJ9.2 22.42,29.46 v23.32,30.35
P2  (via drill 0.6)
  Top 0.254: SV3.21 35.37,26.81 34.14,28.04 24.47,28.04 23.99,27.56 18.69,27.56 18.21,28.04 v15.39,28.04
  Bottom 0.254: SJ7.2 16.01,28.66 v15.39,28.04
P4  (via drill 0.6)
  Top 0.254: v36.15,28.09 34.85,28.09 34.29,28.65 31.93,28.65 SJ8.2
  Bottom 0.254: SV3.19 38.25,25.51 38.25,27.74 37.9,28.09 v36.15,28.09
PB0  (via drill 0.6)
  Top 0.254: U1.12 25.6,22.71 v24.84,23.47 | v24.84,26.82 29.18,26.82 v29.57,27.2
  Bottom 0.254: 32.19,33.39 31.71,33.39 30.63,32.31 30.63,28.27 v29.57,27.2 | v24.84,23.47 v24.84,26.82
  Bottom 0.406: PAD8.1 32.19,33.39
PC1  (via drill 0.6)
  Top 0.254: U1.24 20.02,13.92 19.81,13.72 19.81,12.86 v20.24,12.43 | v18.42,6.3 15.75,6.3 13,3.55 PAD9.1
  Bottom 0.254: v20.24,12.43 20.24,10.18 18.42,8.36 v18.42,6.3
PC2  (via drill 0.6)
  Top 0.254: U1.25 22.4,11.58 21.51,10.69 15.06,10.69 v14.33,11.43 13.87,11.43 13.41,11.89 11.62,11.89 11.47,12.04 11.47,12.46 10.67,13.26 7.16,13.26 SJ10.2
  Bottom 0.254: PAD10.1 14.02,23.35 14.02,11.73 v14.33,11.43
PC3  (via drill 0.6)
  Top 0.254: U1.26 23.2,14.94 23.38,15.12 25.29,15.12 v25.33,15.08 | v27.45,8.98 32.55,8.98 PAD11.1
  Bottom 0.254: v27.45,8.98 25.33,11.1 v25.33,15.08
PD2  (via drill 0.6)
  Top 0.254: U1.32 28,10.78 26.5,9.28 v26.5,8.1
  Bottom 0.254: PAD14.1 23,4.6 v26.5,8.1
PD7
  Top 0.254: PAD12.1 33.47,23.68 32.92,24.23 27.28,24.23 26.4,23.35 U1.11
PO1  (via drill 0.6)
  Top 0.61: IC1.18 10.11,30.75 v9.28,31.59
  Bottom 0.406: 9.38,35.78 Q5.4
  Bottom 0.61: PAD3.1 13,46.77 9.56,43.33 Q5.2 9.56,41.1 10.68,39.98 10.68,37.08 Q5.4 9.28,35.69 v9.28,31.59
PO2  (via drill 0.6)
  Top 0.61: IC1.13 14.58,37.1 v14.74,36.94
  Bottom 0.61: PAD4.1 18,43.97 16.97,42.94 Q4.2 Q4.4 15.76,35.92 v14.74,36.94
PO3  (via drill 0.6)
  Top 0.61: IC1.8 22.04,37.1 v22.29,37.35
  Bottom 0.406: 24.32,38.57 24.34,38.55
  Bottom 0.61: 24.34,37.58 24.34,37.85 24.34,38.55 Q3.2 24.34,42.73 23,44.07 PAD5.1 | v22.29,37.35 24.11,37.35 24.34,37.58 | Q3.4 24.34,37.58
PO4  (via drill 0.6)
  Top 0.61: 29.69,32.31 v29.7,32.32 23.53,32.32 21.97,30.75 IC1.3
  Bottom 0.61: v29.7,32.32 29.7,34.1 Q2.4 Q2.2 31.49,43.51 30.88,44.12 28.25,44.12 28,44.37 PAD6.1
PWRONN  (via drill 0.6)
  Top 0.254: SJ10.1 6.55,15.39 3.35,15.39 2.74,16 2.74,30.18 3.2,30.63 v4.88,30.63
  Bottom 0.254: v4.88,30.63 5.18,30.94 5.18,33.24 SV2.28
RESET  (via drill 0.6)
  Top 0.254: U1.29 25.6,10.97 23.93,9.3 13.34,9.3 11.98,7.94 v11.98,7.89
  Bottom 0.254: C12.1 10.82,6.73 v11.98,7.89 11.43,8.44 11.43,19.78 JP2.5 11,22.95 R1.1
  Bottom 0.406: 11.96,7.92 v11.98,7.89
RX_PC  (via drill 0.6)
  Top 0.254: U1.31 27.2,10.74 24.84,8.38 15.45,8.38 v14.96,7.89 | v12.83,11.09 11.44,11.09 10.52,12.01 SV1.5
  Top 0.406: SV1.5
  Bottom 0.254: v12.83,11.09 12.83,10.03 v14.96,7.89
SCK  (via drill 0.6)
  Top 0.254: U1.28 24.8,11.08 23.47,9.75 12.19,9.75 10.21,7.77 2.84,7.77 v2.76,7.85
  Bottom 0.406: SV2.25 2.76,30.58 v2.76,7.85
SCL2  (via drill 0.6)
  Top 0.254: 39.55,13.65 38.3,12.4 38.3,10.57 38.04,10.31 36.01,10.31 34.86,11.46 32.22,11.46 v32.18,11.5
  Top 0.406: SV3.12 39.55,13.65
  Bottom 0.254: 31.86,11.82 v32.18,11.5 30.9,12.78 30.9,18.9 31.09,19.09 JP3.3
SDA  (via drill 0.6)
  Top 0.254: SV2.27 2.7,33.18 6.97,33.18 v7.19,32.96 | U1.27 24,11.05 23.16,10.21 11.58,10.21 11.12,10.67 7.46,10.67 v7.33,10.8
  Bottom 0.254: v7.33,10.8 7.19,10.94 v7.19,32.96
  Bottom 0.406: 7.1,32.87 v7.19,32.96
SDA2
  Top 0.254: SV3.11 35.45,14.11 35.24,14.31 35.24,16.34 34.91,16.67 33.39,16.67
  Top 0.406: 33.39,16.67 JP3.2
TX_PC  (via drill 0.5, 0.6)
  Top 0.254: U1.30 26.4,10.86 24.38,8.84 14.42,8.84 v13.47,7.89 | 9.5,14.63 SV1.4 10.14,14.55 12.04,12.65 v12.34,12.65
  Top 0.406: 9.47,14.6 SV1.4
  Bottom 0.254: v13.47,7.89 v13.48,7.9 12.04,9.34 12.04,12.34 v12.34,12.65
VCC  (via drill 0.6)
  Top 0.254: U1.18 17.99,18.72 JP2.2 | SJ2.2 8.53,25.12 8.53,24.23 7.32,23.01 7.32,18.75 7.62,18.44 11.12,18.44 12.04,17.53 C5.2 12.15,16.33 LED1.VDD
  Top 0.406: U1.18 27.2,18.72 29.64,21.16 30.15,21.16 v30.51,21.52 31.57,21.52 31.74,21.35 31.74,17.86 | 31.12,17.92 U1.6 31.68,17.92 31.74,17.86 | U1.4 31.52,16.32 31.74,16.54 31.74,17.86 | 9.32,24.84 8.91,24.84 SJ2.2 | v31.16,27.05 30.02,25.91 14.33,25.91 13.87,26.36 10.52,26.36 10.06,25.91 9.91,26.06 | IC2.14 32.93,40.96 v33.87,40.02 33.82,39.96 C3.2 | 9.89,27.38 8.81,27.38 C2.2 8.73,28.14 9.21,28.61 v9.21,29.05
  Top 0.61: 9.91,25.43 9.91,26.06 | 9.91,25.43 9.32,24.84 | 9.91,25.43 9.89,25.44 9.89,27.38 9.89,28.17 11.35,28.17 IC1.20
  Bottom 0.406: 32.31,21.16 C1.2 | C1.2 31.94,21.4 31.82,21.52 v30.51,21.52 30.93,21.94 SJ4.1 30.9,23.65 30.9,26.79 v31.16,27.05 31.79,27.68 SJ3.2 | 31.74,21.12 C1.2 | 31.8,29.41 SJ3.2 | R1.2 9.69,30.42 9.21,29.93 v9.21,29.05 | v33.87,40.02 34,39.89 34,32.52 33.77,32.29 33.4,32.29 31.79,30.68 SJ3.2
VIN
  Top 0.406: 22.44,42.75 22.24,42.95 | 8.2,42.95 8,43.16 7.83,43.32 | SJ1.2 4.22,47.25
  Top 0.61: C4.1 7.42,42.58 8,43.16 | SJ1.2 7.75,47.25
  Top 0.813: 22.44,42.75 22.44,40.09 22.05,39.7 20.66,39.7 IC1.10 | 22.24,42.95 8.2,42.95 | 7.83,43.32 7.83,46.83
  Bottom 0.813: PAD2.1 6.74,47 5.66,45.92 5.66,36.9 SJ5.2
  pour Top (isolate 0.305, no thermals): 7.01,47.14 6.52,49.82 6.29,40.15 8.59,40.2 6.29,40.14 6.31,39.97 8.56,40.03 9.7,40.98 19.67,40.96 19.61,39.46 22.56,39.52 22.74,39.87 22.68,42.94 22.4,43.22 15.4,43.22 13.9,44.72 10.59,44.72 9.57,45.74 9.57,47.2 9.29,47.48 7.29,47.48 7.1,47.29
VIN2  (via drill 0.6)
  Top 0.61: SJ2.1 5.86,25.17 v5.45,25.58
  Bottom 0.406: 6.01,28.23 6.02,28.24 | v5.45,25.58 5.45,25.62 6.02,26.19
  Bottom 0.813: PAD17.1 6.02,4.98 6.02,26.19 6.02,28.24 6.02,34.15 SJ5.1
VIN3  (via drill 0.6)
  Top 0.406: v30.59,45.31 30.59,44.91 31.14,44.36 31.55,44.36 v34.62,44.36
  Top 0.61: SV2.36 2.77,45.81 SJ1.1
  Bottom 0.406: SV2.36 3.99,46.75 6.39,49.15 30.1,49.15 30.57,48.68 30.57,45.34 v30.59,45.31 | U2.VBUS1 35.01,44.75 v34.62,44.36

### Text on the board
Bottom: C.H.I.P. SALSA DIP / v2.7 JKW
tStop: 9 | 10 | 11 | 8: A_IN | 5V | 4:ADC | 5:C_IN | 6:A_IN | 7:NEO | GND
bStop: 5V | 0:PWM | 1:PWM | 2:PWM | 3:PWM | GND | 12 | C.H.I.P. SALSA DIP / v2.7 JKW | 5V | 4:ADC | 5:C_IN | 7:NEO | GND | 6:A_IN